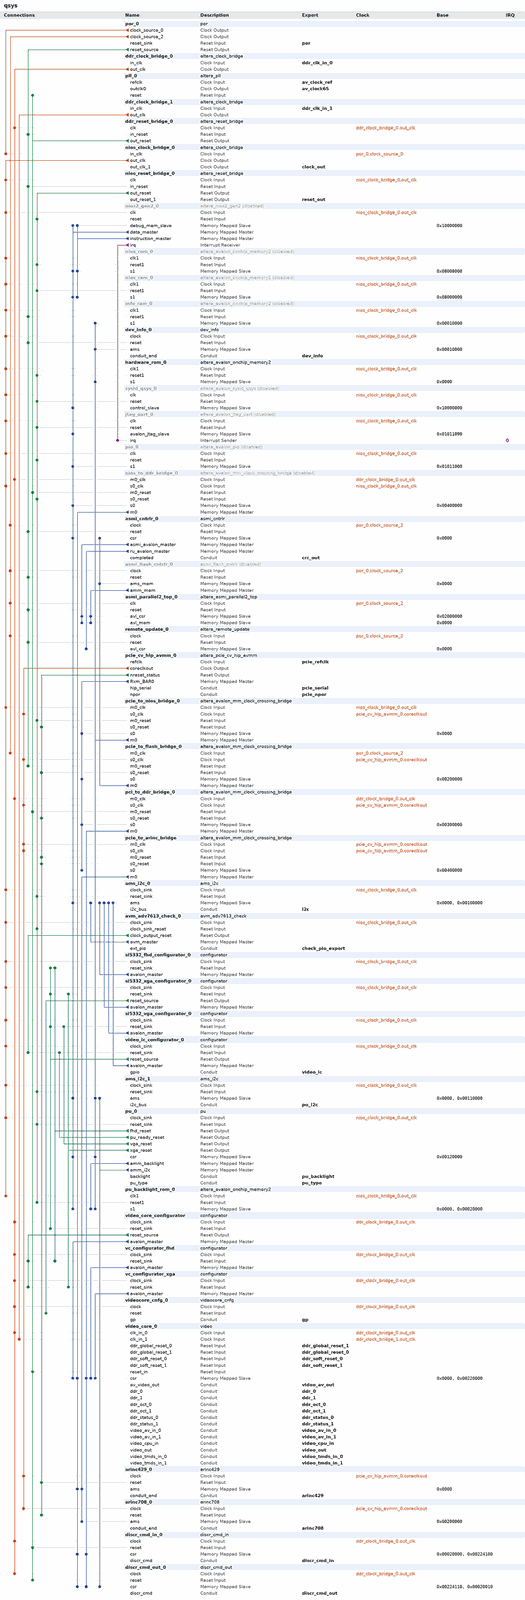
[diagram p0: system contents, whole]
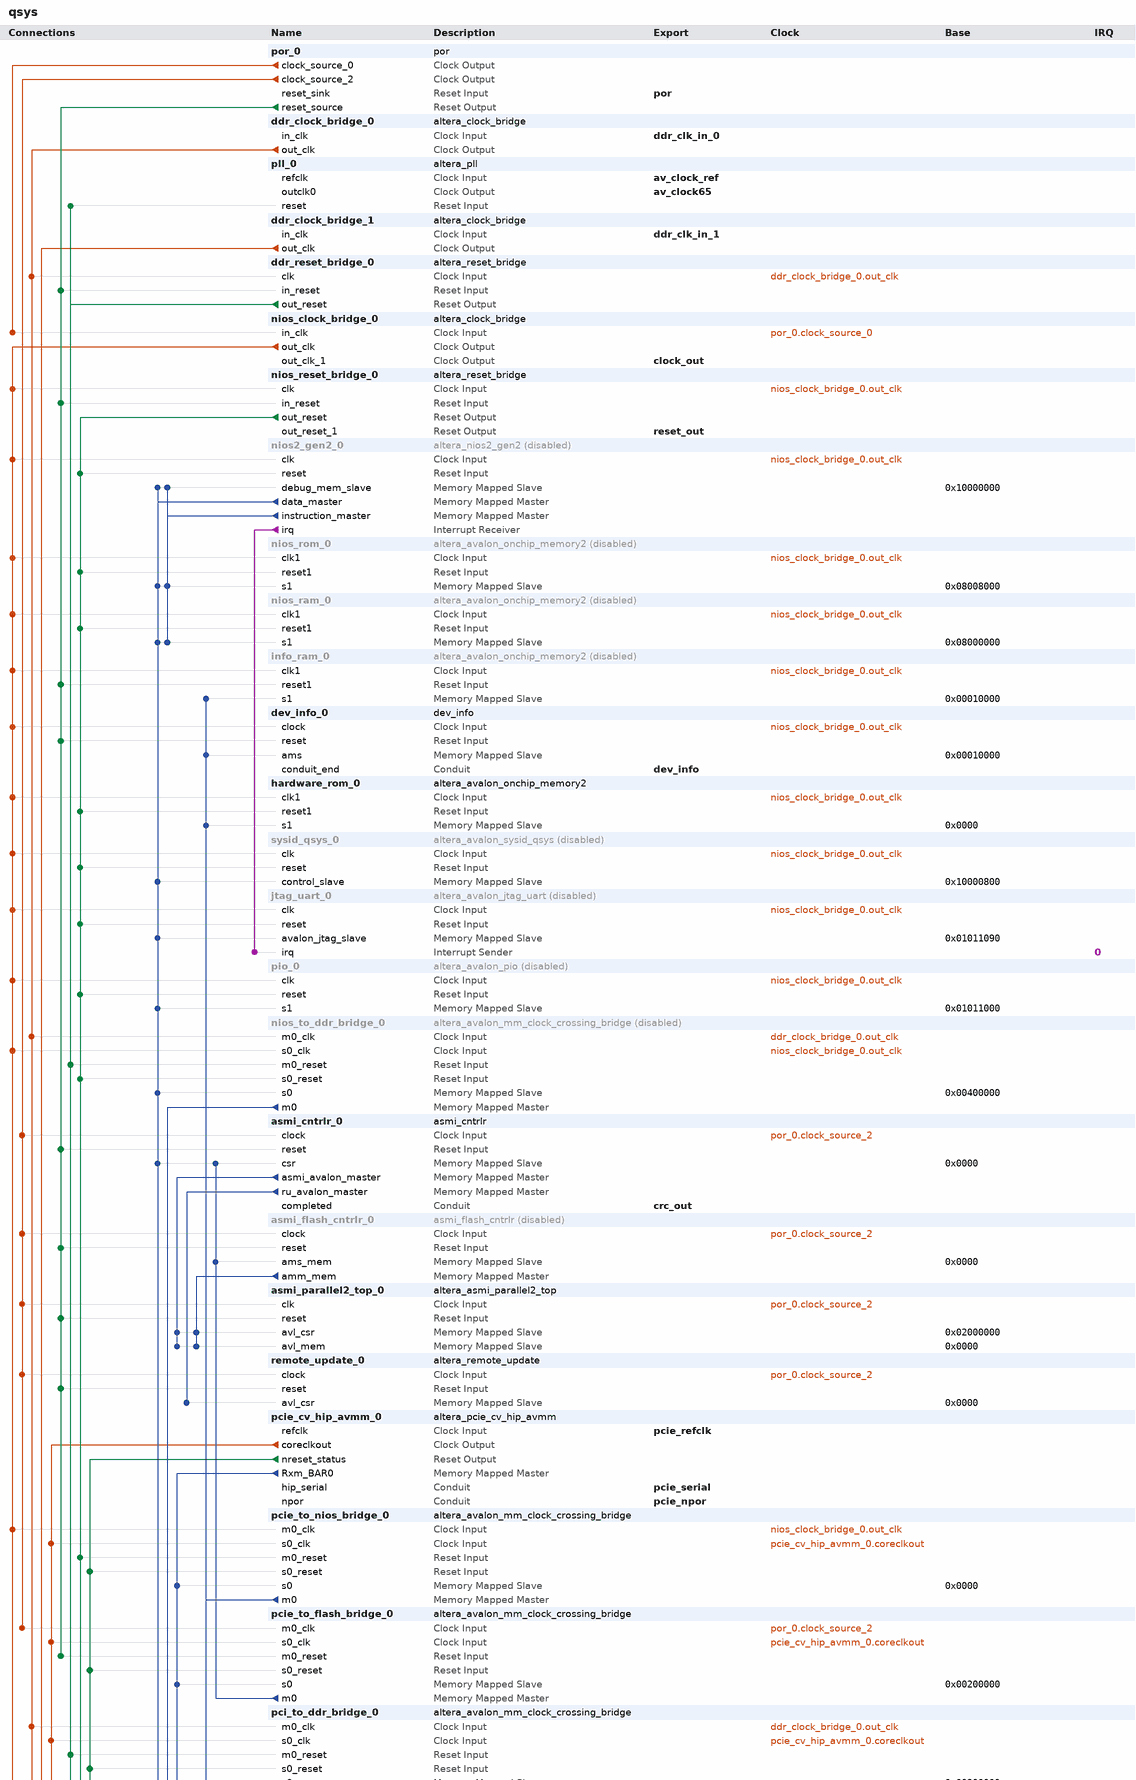
[diagram p1: system contents, upper part]
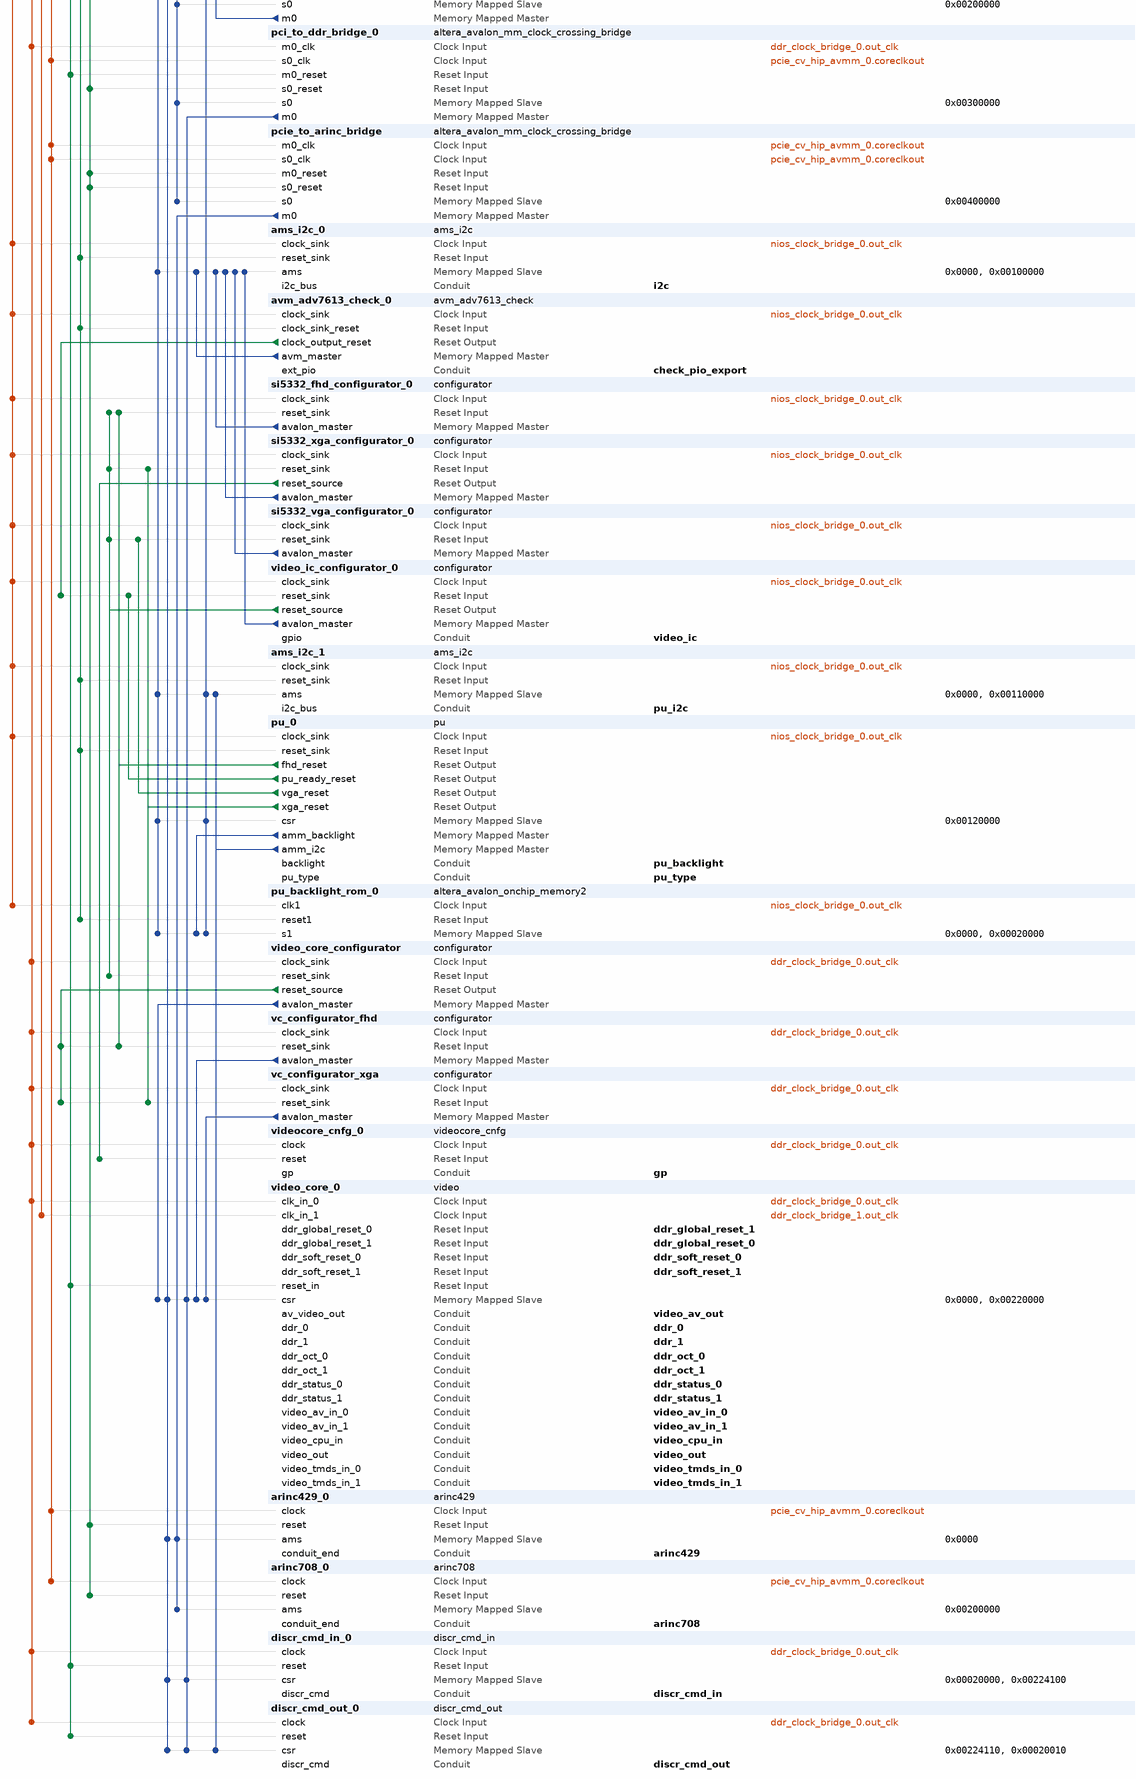
[diagram p2: system contents, lower part]
# Platform Designer (Qsys) system qsys, Cyclone V 5CGXFC7D6F31I7
# Parameters at their usual value, and those the tool derives, are not listed.
package require -exact qsys 18.1
create_system qsys
set_project_property DEVICE_FAMILY {Cyclone V}
set_project_property DEVICE 5CGXFC7D6F31I7

add_instance por_0 por 18.1
set_instance_parameter_value por_0 FAMILY {Cyclone V}

add_instance ddr_clock_bridge_0 altera_clock_bridge 18.1
set_instance_parameter_value ddr_clock_bridge_0 DERIVED_CLOCK_RATE 0
set_instance_parameter_value ddr_clock_bridge_0 EXPLICIT_CLOCK_RATE 100000000

add_instance pll_0 altera_pll 18.1
set_instance_parameter_value pll_0 gui_device_speed_grade 1
set_instance_parameter_value pll_0 gui_number_of_clocks 1
set_instance_parameter_value pll_0 gui_operation_mode normal
set_instance_parameter_value pll_0 gui_output_clock_frequency0 65.0
set_instance_parameter_value pll_0 gui_pll_mode {Integer-N PLL}
set_instance_parameter_value pll_0 gui_reference_clock_frequency 100.0
set_instance_parameter_value pll_0 gui_use_locked false

add_instance ddr_clock_bridge_1 altera_clock_bridge 18.1
set_instance_parameter_value ddr_clock_bridge_1 DERIVED_CLOCK_RATE 0
set_instance_parameter_value ddr_clock_bridge_1 EXPLICIT_CLOCK_RATE 100000000

add_instance ddr_reset_bridge_0 altera_reset_bridge 18.1
set_instance_parameter_value ddr_reset_bridge_0 ACTIVE_LOW_RESET 1
set_instance_parameter_value ddr_reset_bridge_0 SYNCHRONOUS_EDGES deassert
set_instance_parameter_value ddr_reset_bridge_0 USE_RESET_REQUEST 1

add_instance nios_clock_bridge_0 altera_clock_bridge 18.1
set_instance_parameter_value nios_clock_bridge_0 DERIVED_CLOCK_RATE 0
set_instance_parameter_value nios_clock_bridge_0 EXPLICIT_CLOCK_RATE 80000000
set_instance_parameter_value nios_clock_bridge_0 NUM_CLOCK_OUTPUTS 2

add_instance nios_reset_bridge_0 altera_reset_bridge 18.1
set_instance_parameter_value nios_reset_bridge_0 ACTIVE_LOW_RESET 1
set_instance_parameter_value nios_reset_bridge_0 NUM_RESET_OUTPUTS 2
set_instance_parameter_value nios_reset_bridge_0 SYNCHRONOUS_EDGES deassert
set_instance_parameter_value nios_reset_bridge_0 USE_RESET_REQUEST 1

add_instance nios2_gen2_0 altera_nios2_gen2 18.1
set_instance_property nios2_gen2_0 ENABLED false
set_instance_parameter_value nios2_gen2_0 dcache_size 0
set_instance_parameter_value nios2_gen2_0 debug_datatrigger 2
set_instance_parameter_value nios2_gen2_0 debug_hwbreakpoint 2
set_instance_parameter_value nios2_gen2_0 exceptionSlave nios_rom_0.s1
set_instance_parameter_value nios2_gen2_0 icache_size 0
set_instance_parameter_value nios2_gen2_0 impl Tiny
set_instance_parameter_value nios2_gen2_0 resetSlave nios_rom_0.s1
set_instance_parameter_value nios2_gen2_0 setting_branchpredictiontype Static

add_instance nios_rom_0 altera_avalon_onchip_memory2 18.1
set_instance_property nios_rom_0 ENABLED false
set_instance_parameter_value nios_rom_0 dataWidth 32
set_instance_parameter_value nios_rom_0 dualPort false
set_instance_parameter_value nios_rom_0 initMemContent true
set_instance_parameter_value nios_rom_0 initializationFileName nios_rom.hex
set_instance_parameter_value nios_rom_0 instanceID NIOS
set_instance_parameter_value nios_rom_0 memorySize 32768
set_instance_parameter_value nios_rom_0 useNonDefaultInitFile true
set_instance_parameter_value nios_rom_0 writable false

add_instance nios_ram_0 altera_avalon_onchip_memory2 18.1
set_instance_property nios_ram_0 ENABLED false
set_instance_parameter_value nios_ram_0 dataWidth 32
set_instance_parameter_value nios_ram_0 dualPort false
set_instance_parameter_value nios_ram_0 initMemContent true
set_instance_parameter_value nios_ram_0 initializationFileName nios_ram.hex
set_instance_parameter_value nios_ram_0 instanceID NIOS
set_instance_parameter_value nios_ram_0 memorySize 8192
set_instance_parameter_value nios_ram_0 useNonDefaultInitFile true

add_instance info_ram_0 altera_avalon_onchip_memory2 18.1
set_instance_property info_ram_0 ENABLED false
set_instance_parameter_value info_ram_0 dataWidth 32
set_instance_parameter_value info_ram_0 dualPort false
set_instance_parameter_value info_ram_0 initMemContent true
set_instance_parameter_value info_ram_0 initializationFileName info_ram.hex
set_instance_parameter_value info_ram_0 instanceID NIOS
set_instance_parameter_value info_ram_0 memorySize 1024
set_instance_parameter_value info_ram_0 useNonDefaultInitFile true

add_instance dev_info_0 dev_info 1.0
set_instance_parameter_value dev_info_0 INPUT_CLOCK 80000000

add_instance hardware_rom_0 altera_avalon_onchip_memory2 18.1
set_instance_parameter_value hardware_rom_0 dataWidth 32
set_instance_parameter_value hardware_rom_0 dualPort false
set_instance_parameter_value hardware_rom_0 initMemContent true
set_instance_parameter_value hardware_rom_0 initializationFileName hrom.hex
set_instance_parameter_value hardware_rom_0 instanceID HW
set_instance_parameter_value hardware_rom_0 memorySize 4096
set_instance_parameter_value hardware_rom_0 useNonDefaultInitFile true
set_instance_parameter_value hardware_rom_0 writable false

add_instance sysid_qsys_0 altera_avalon_sysid_qsys 18.1
set_instance_property sysid_qsys_0 ENABLED false
set_instance_parameter_value sysid_qsys_0 id 16777216

add_instance jtag_uart_0 altera_avalon_jtag_uart 18.1
set_instance_property jtag_uart_0 ENABLED false
set_instance_parameter_value jtag_uart_0 simInteractiveOptions NO_INTERACTIVE_WINDOWS

add_instance pio_0 altera_avalon_pio 18.1
set_instance_property pio_0 ENABLED false
set_instance_parameter_value pio_0 bitModifyingOutReg true
set_instance_parameter_value pio_0 direction InOut
set_instance_parameter_value pio_0 edgeType ANY
set_instance_parameter_value pio_0 width 32

add_instance nios_to_ddr_bridge_0 altera_avalon_mm_clock_crossing_bridge 18.1
set_instance_property nios_to_ddr_bridge_0 ENABLED false
set_instance_parameter_value nios_to_ddr_bridge_0 ADDRESS_UNITS WORDS
set_instance_parameter_value nios_to_ddr_bridge_0 ADDRESS_WIDTH 24
set_instance_parameter_value nios_to_ddr_bridge_0 COMMAND_FIFO_DEPTH 256
set_instance_parameter_value nios_to_ddr_bridge_0 DATA_WIDTH 32
set_instance_parameter_value nios_to_ddr_bridge_0 MASTER_SYNC_DEPTH 3
set_instance_parameter_value nios_to_ddr_bridge_0 MAX_BURST_SIZE 1
set_instance_parameter_value nios_to_ddr_bridge_0 RESPONSE_FIFO_DEPTH 256
set_instance_parameter_value nios_to_ddr_bridge_0 SLAVE_SYNC_DEPTH 3
set_instance_parameter_value nios_to_ddr_bridge_0 USE_AUTO_ADDRESS_WIDTH 1

add_instance asmi_cntrlr_0 asmi_cntrlr 1.0

add_instance asmi_flash_cntrlr_0 asmi_flash_cntrlr 1.0
set_instance_property asmi_flash_cntrlr_0 ENABLED false
set_instance_parameter_value asmi_flash_cntrlr_0 ASMI_CSR 33554432

add_instance asmi_parallel2_top_0 altera_asmi_parallel2_top 18.1
set_instance_parameter_value asmi_parallel2_top_0 CHIP_SELECT_EN true
set_instance_parameter_value asmi_parallel2_top_0 DATA_WIDTH QUAD
set_instance_parameter_value asmi_parallel2_top_0 ENABLE_SIM_MODEL false
set_instance_parameter_value asmi_parallel2_top_0 FLASH_TYPE EPCQL256
set_instance_parameter_value asmi_parallel2_top_0 NCS_NUM 1
set_instance_parameter_value asmi_parallel2_top_0 PIPE_CMD_GEN_CMD 0
set_instance_parameter_value asmi_parallel2_top_0 PIPE_CSR 0
set_instance_parameter_value asmi_parallel2_top_0 PIPE_MUX_CMD 0
set_instance_parameter_value asmi_parallel2_top_0 PIPE_XIP 0
set_instance_parameter_value asmi_parallel2_top_0 USE_ASMIBLOCK false
set_instance_parameter_value asmi_parallel2_top_0 USE_GPIO false

add_instance remote_update_0 altera_remote_update 18.1
set_instance_parameter_value remote_update_0 CBX_AUTO_BLACKBOX ALL
set_instance_parameter_value remote_update_0 DEVICE 5CGXFC7D6F31I7
set_instance_parameter_value remote_update_0 GUI_config_device MT25QL256
set_instance_parameter_value remote_update_0 check_app_pof false
set_instance_parameter_value remote_update_0 check_avalon_interface true
set_instance_parameter_value remote_update_0 m_support_write_config_check true
set_instance_parameter_value remote_update_0 operation_mode REMOTE

add_instance pcie_cv_hip_avmm_0 altera_pcie_cv_hip_avmm 18.1
set_instance_parameter_value pcie_cv_hip_avmm_0 AST_LITE 0
set_instance_parameter_value pcie_cv_hip_avmm_0 AVALON_ADDR_WIDTH 32
set_instance_parameter_value pcie_cv_hip_avmm_0 AddressPage "0\\,1\\,2\\,3\\,4\\,5\\,6\\,7\\,8\\,9\\,10\\,11\\,12\\,13\\,14\\,15"
set_instance_parameter_value pcie_cv_hip_avmm_0 BYPASSS_A2P_TRANSLATION 0
set_instance_parameter_value pcie_cv_hip_avmm_0 CB_A2P_ADDR_MAP_FIXED_TABLE_0_HIGH 0
set_instance_parameter_value pcie_cv_hip_avmm_0 CB_A2P_ADDR_MAP_FIXED_TABLE_0_LOW 0
set_instance_parameter_value pcie_cv_hip_avmm_0 CB_A2P_ADDR_MAP_FIXED_TABLE_10_HIGH 0
set_instance_parameter_value pcie_cv_hip_avmm_0 CB_A2P_ADDR_MAP_FIXED_TABLE_10_LOW 0
set_instance_parameter_value pcie_cv_hip_avmm_0 CB_A2P_ADDR_MAP_FIXED_TABLE_11_HIGH 0
set_instance_parameter_value pcie_cv_hip_avmm_0 CB_A2P_ADDR_MAP_FIXED_TABLE_11_LOW 0
set_instance_parameter_value pcie_cv_hip_avmm_0 CB_A2P_ADDR_MAP_FIXED_TABLE_12_HIGH 0
set_instance_parameter_value pcie_cv_hip_avmm_0 CB_A2P_ADDR_MAP_FIXED_TABLE_12_LOW 0
set_instance_parameter_value pcie_cv_hip_avmm_0 CB_A2P_ADDR_MAP_FIXED_TABLE_13_HIGH 0
set_instance_parameter_value pcie_cv_hip_avmm_0 CB_A2P_ADDR_MAP_FIXED_TABLE_13_LOW 0
set_instance_parameter_value pcie_cv_hip_avmm_0 CB_A2P_ADDR_MAP_FIXED_TABLE_14_HIGH 0
set_instance_parameter_value pcie_cv_hip_avmm_0 CB_A2P_ADDR_MAP_FIXED_TABLE_14_LOW 0
set_instance_parameter_value pcie_cv_hip_avmm_0 CB_A2P_ADDR_MAP_FIXED_TABLE_15_HIGH 0
set_instance_parameter_value pcie_cv_hip_avmm_0 CB_A2P_ADDR_MAP_FIXED_TABLE_15_LOW 0
set_instance_parameter_value pcie_cv_hip_avmm_0 CB_A2P_ADDR_MAP_FIXED_TABLE_1_HIGH 0
set_instance_parameter_value pcie_cv_hip_avmm_0 CB_A2P_ADDR_MAP_FIXED_TABLE_1_LOW 0
set_instance_parameter_value pcie_cv_hip_avmm_0 CB_A2P_ADDR_MAP_FIXED_TABLE_2_HIGH 0
set_instance_parameter_value pcie_cv_hip_avmm_0 CB_A2P_ADDR_MAP_FIXED_TABLE_2_LOW 0
set_instance_parameter_value pcie_cv_hip_avmm_0 CB_A2P_ADDR_MAP_FIXED_TABLE_3_HIGH 0
set_instance_parameter_value pcie_cv_hip_avmm_0 CB_A2P_ADDR_MAP_FIXED_TABLE_3_LOW 0
set_instance_parameter_value pcie_cv_hip_avmm_0 CB_A2P_ADDR_MAP_FIXED_TABLE_4_HIGH 0
set_instance_parameter_value pcie_cv_hip_avmm_0 CB_A2P_ADDR_MAP_FIXED_TABLE_4_LOW 0
set_instance_parameter_value pcie_cv_hip_avmm_0 CB_A2P_ADDR_MAP_FIXED_TABLE_5_HIGH 0
set_instance_parameter_value pcie_cv_hip_avmm_0 CB_A2P_ADDR_MAP_FIXED_TABLE_5_LOW 0
set_instance_parameter_value pcie_cv_hip_avmm_0 CB_A2P_ADDR_MAP_FIXED_TABLE_6_HIGH 0
set_instance_parameter_value pcie_cv_hip_avmm_0 CB_A2P_ADDR_MAP_FIXED_TABLE_6_LOW 0
set_instance_parameter_value pcie_cv_hip_avmm_0 CB_A2P_ADDR_MAP_FIXED_TABLE_7_HIGH 0
set_instance_parameter_value pcie_cv_hip_avmm_0 CB_A2P_ADDR_MAP_FIXED_TABLE_7_LOW 0
set_instance_parameter_value pcie_cv_hip_avmm_0 CB_A2P_ADDR_MAP_FIXED_TABLE_8_HIGH 0
set_instance_parameter_value pcie_cv_hip_avmm_0 CB_A2P_ADDR_MAP_FIXED_TABLE_8_LOW 0
set_instance_parameter_value pcie_cv_hip_avmm_0 CB_A2P_ADDR_MAP_FIXED_TABLE_9_HIGH 0
set_instance_parameter_value pcie_cv_hip_avmm_0 CB_A2P_ADDR_MAP_FIXED_TABLE_9_LOW 0
set_instance_parameter_value pcie_cv_hip_avmm_0 CB_A2P_ADDR_MAP_IS_FIXED 0
set_instance_parameter_value pcie_cv_hip_avmm_0 CB_A2P_ADDR_MAP_NUM_ENTRIES 2
set_instance_parameter_value pcie_cv_hip_avmm_0 CB_A2P_ADDR_MAP_PASS_THRU_BITS 20
set_instance_parameter_value pcie_cv_hip_avmm_0 CB_P2A_AVALON_ADDR_B0 0x00000000
set_instance_parameter_value pcie_cv_hip_avmm_0 CB_P2A_AVALON_ADDR_B1 0x00000000
set_instance_parameter_value pcie_cv_hip_avmm_0 CB_P2A_AVALON_ADDR_B2 0x00000000
set_instance_parameter_value pcie_cv_hip_avmm_0 CB_P2A_AVALON_ADDR_B3 0x00000000
set_instance_parameter_value pcie_cv_hip_avmm_0 CB_P2A_AVALON_ADDR_B4 0x00000000
set_instance_parameter_value pcie_cv_hip_avmm_0 CB_P2A_AVALON_ADDR_B5 0x00000000
set_instance_parameter_value pcie_cv_hip_avmm_0 CB_P2A_FIXED_AVALON_ADDR_B0 0
set_instance_parameter_value pcie_cv_hip_avmm_0 CB_P2A_FIXED_AVALON_ADDR_B1 0
set_instance_parameter_value pcie_cv_hip_avmm_0 CB_P2A_FIXED_AVALON_ADDR_B2 0
set_instance_parameter_value pcie_cv_hip_avmm_0 CB_P2A_FIXED_AVALON_ADDR_B3 0
set_instance_parameter_value pcie_cv_hip_avmm_0 CB_P2A_FIXED_AVALON_ADDR_B4 0
set_instance_parameter_value pcie_cv_hip_avmm_0 CB_P2A_FIXED_AVALON_ADDR_B5 0
set_instance_parameter_value pcie_cv_hip_avmm_0 CB_PCIE_MODE 1
set_instance_parameter_value pcie_cv_hip_avmm_0 CB_PCIE_RX_LITE 1
set_instance_parameter_value pcie_cv_hip_avmm_0 CB_RP_S_ADDR_WIDTH 32
set_instance_parameter_value pcie_cv_hip_avmm_0 CG_COMMON_CLOCK_MODE 1
set_instance_parameter_value pcie_cv_hip_avmm_0 CG_ENABLE_A2P_INTERRUPT 1
set_instance_parameter_value pcie_cv_hip_avmm_0 CG_ENABLE_ADVANCED_INTERRUPT 0
set_instance_parameter_value pcie_cv_hip_avmm_0 CG_ENABLE_HIP_STATUS 0
set_instance_parameter_value pcie_cv_hip_avmm_0 CG_ENABLE_HIP_STATUS_EXTENSION 0
set_instance_parameter_value pcie_cv_hip_avmm_0 CG_IMPL_CRA_AV_SLAVE_PORT 0
set_instance_parameter_value pcie_cv_hip_avmm_0 CG_RXM_IRQ_NUM 16
set_instance_parameter_value pcie_cv_hip_avmm_0 NUM_PREFETCH_MASTERS 1
set_instance_parameter_value pcie_cv_hip_avmm_0 PCIeAddress31_0 "0x00000000\\,0x00000000\\,0x00000000\\,0x00000000\\,0x00000000\\,0x00000000\\,0x00000000\\,0x00000000\\,0x00000000\\,0x00000000\\,0x00000000\\,0x00000000\\,0x00000000\\,0x00000000\\,0x00000000\\,0x00000000"
set_instance_parameter_value pcie_cv_hip_avmm_0 PCIeAddress63_32 "0x00000000\\,0x00000000\\,0x00000000\\,0x00000000\\,0x00000000\\,0x00000000\\,0x00000000\\,0x00000000\\,0x00000000\\,0x00000000\\,0x00000000\\,0x00000000\\,0x00000000\\,0x00000000\\,0x00000000\\,0x00000000"
set_instance_parameter_value pcie_cv_hip_avmm_0 RXM_BEN_WIDTH 8
set_instance_parameter_value pcie_cv_hip_avmm_0 RXM_DATA_WIDTH 64
set_instance_parameter_value pcie_cv_hip_avmm_0 SLAVE_ADDRESS_MAP_0 23
set_instance_parameter_value pcie_cv_hip_avmm_0 SLAVE_ADDRESS_MAP_1 0
set_instance_parameter_value pcie_cv_hip_avmm_0 SLAVE_ADDRESS_MAP_2 0
set_instance_parameter_value pcie_cv_hip_avmm_0 SLAVE_ADDRESS_MAP_3 0
set_instance_parameter_value pcie_cv_hip_avmm_0 SLAVE_ADDRESS_MAP_4 0
set_instance_parameter_value pcie_cv_hip_avmm_0 SLAVE_ADDRESS_MAP_5 0
set_instance_parameter_value pcie_cv_hip_avmm_0 TX_S_ADDR_WIDTH 32
set_instance_parameter_value pcie_cv_hip_avmm_0 advanced_default_parameter_override 0
set_instance_parameter_value pcie_cv_hip_avmm_0 altpcie_avmm_hwtcl 1
set_instance_parameter_value pcie_cv_hip_avmm_0 atomic_malformed_hwtcl true
set_instance_parameter_value pcie_cv_hip_avmm_0 atomic_op_completer_32bit_hwtcl false
set_instance_parameter_value pcie_cv_hip_avmm_0 atomic_op_completer_64bit_hwtcl false
set_instance_parameter_value pcie_cv_hip_avmm_0 atomic_op_routing_hwtcl false
set_instance_parameter_value pcie_cv_hip_avmm_0 avmm_width_hwtcl 64
set_instance_parameter_value pcie_cv_hip_avmm_0 bar0_type_hwtcl 2
set_instance_parameter_value pcie_cv_hip_avmm_0 bar1_type_hwtcl 0
set_instance_parameter_value pcie_cv_hip_avmm_0 bar2_type_hwtcl 0
set_instance_parameter_value pcie_cv_hip_avmm_0 bar3_type_hwtcl 0
set_instance_parameter_value pcie_cv_hip_avmm_0 bar4_type_hwtcl 0
set_instance_parameter_value pcie_cv_hip_avmm_0 bar5_type_hwtcl 0
set_instance_parameter_value pcie_cv_hip_avmm_0 bridge_port_ssid_support_hwtcl false
set_instance_parameter_value pcie_cv_hip_avmm_0 bridge_port_vga_enable_hwtcl false
set_instance_parameter_value pcie_cv_hip_avmm_0 bypass_cdc_hwtcl false
set_instance_parameter_value pcie_cv_hip_avmm_0 bypass_tl false
set_instance_parameter_value pcie_cv_hip_avmm_0 cas_completer_128bit_hwtcl false
set_instance_parameter_value pcie_cv_hip_avmm_0 cdc_dummy_insert_limit_advanced_default_hwtcl 11
set_instance_parameter_value pcie_cv_hip_avmm_0 class_code_hwtcl 16711680
set_instance_parameter_value pcie_cv_hip_avmm_0 completion_timeout_hwtcl A
set_instance_parameter_value pcie_cv_hip_avmm_0 coreclkout_hip_phaseshift_hwtcl {0 ps}
set_instance_parameter_value pcie_cv_hip_avmm_0 d0_pme_advanced_default_hwtcl false
set_instance_parameter_value pcie_cv_hip_avmm_0 d1_pme_advanced_default_hwtcl false
set_instance_parameter_value pcie_cv_hip_avmm_0 d1_support_advanced_default_hwtcl false
set_instance_parameter_value pcie_cv_hip_avmm_0 d2_pme_advanced_default_hwtcl false
set_instance_parameter_value pcie_cv_hip_avmm_0 d2_support_advanced_default_hwtcl false
set_instance_parameter_value pcie_cv_hip_avmm_0 d3_cold_pme_advanced_default_hwtcl false
set_instance_parameter_value pcie_cv_hip_avmm_0 d3_hot_pme_advanced_default_hwtcl false
set_instance_parameter_value pcie_cv_hip_avmm_0 data_pack_rx_hwtcl disable
set_instance_parameter_value pcie_cv_hip_avmm_0 deemphasis_enable_advanced_default_hwtcl false
set_instance_parameter_value pcie_cv_hip_avmm_0 deskew_comma_hwtcl skp_eieos_deskw
set_instance_parameter_value pcie_cv_hip_avmm_0 device_id_hwtcl 2
set_instance_parameter_value pcie_cv_hip_avmm_0 device_number_advanced_default_hwtcl 0
set_instance_parameter_value pcie_cv_hip_avmm_0 diffclock_nfts_count_advanced_default_hwtcl 255
set_instance_parameter_value pcie_cv_hip_avmm_0 disable_link_x2_support_advanced_default_hwtcl false
set_instance_parameter_value pcie_cv_hip_avmm_0 disable_snoop_packet_hwtcl false
set_instance_parameter_value pcie_cv_hip_avmm_0 dll_active_report_support_hwtcl 0
set_instance_parameter_value pcie_cv_hip_avmm_0 ecrc_check_capable_hwtcl 0
set_instance_parameter_value pcie_cv_hip_avmm_0 ecrc_gen_capable_hwtcl 0
set_instance_parameter_value pcie_cv_hip_avmm_0 ei_delay_powerdown_count_advanced_default_hwtcl 10
set_instance_parameter_value pcie_cv_hip_avmm_0 eie_before_nfts_count_advanced_default_hwtcl 4
set_instance_parameter_value pcie_cv_hip_avmm_0 enable_completion_timeout_disable_hwtcl 0
set_instance_parameter_value pcie_cv_hip_avmm_0 enable_function_msix_support_hwtcl 0
set_instance_parameter_value pcie_cv_hip_avmm_0 enable_l0s_aspm_hwtcl true
set_instance_parameter_value pcie_cv_hip_avmm_0 enable_l1_aspm_advanced_default_hwtcl false
set_instance_parameter_value pcie_cv_hip_avmm_0 enable_rx_buffer_checking_advanced_default_hwtcl false
set_instance_parameter_value pcie_cv_hip_avmm_0 enable_slot_register_hwtcl 0
set_instance_parameter_value pcie_cv_hip_avmm_0 endpoint_l0_latency_hwtcl 0
set_instance_parameter_value pcie_cv_hip_avmm_0 endpoint_l1_latency_hwtcl 0
set_instance_parameter_value pcie_cv_hip_avmm_0 expansion_base_address_register_hwtcl 0
set_instance_parameter_value pcie_cv_hip_avmm_0 extend_tag_field_hwtcl 32
set_instance_parameter_value pcie_cv_hip_avmm_0 extended_format_field_hwtcl true
set_instance_parameter_value pcie_cv_hip_avmm_0 extended_tag_reset_hwtcl false
set_instance_parameter_value pcie_cv_hip_avmm_0 fc_init_timer_advanced_default_hwtcl 1024
set_instance_parameter_value pcie_cv_hip_avmm_0 fixed_address_mode 0
set_instance_parameter_value pcie_cv_hip_avmm_0 flow_control_timeout_count_advanced_default_hwtcl 200
set_instance_parameter_value pcie_cv_hip_avmm_0 flow_control_update_count_advanced_default_hwtcl 30
set_instance_parameter_value pcie_cv_hip_avmm_0 flr_capability_hwtcl 0
set_instance_parameter_value pcie_cv_hip_avmm_0 force_hrc 0
set_instance_parameter_value pcie_cv_hip_avmm_0 force_src 0
set_instance_parameter_value pcie_cv_hip_avmm_0 gen123_lane_rate_mode_hwtcl {Gen1 (2.5 Gbps)}
set_instance_parameter_value pcie_cv_hip_avmm_0 gen2_diffclock_nfts_count_advanced_default_hwtcl 255
set_instance_parameter_value pcie_cv_hip_avmm_0 gen2_sameclock_nfts_count_advanced_default_hwtcl 255
set_instance_parameter_value pcie_cv_hip_avmm_0 gen3_rxfreqlock_counter_hwtcl 0
set_instance_parameter_value pcie_cv_hip_avmm_0 hip_reconfig_hwtcl 0
set_instance_parameter_value pcie_cv_hip_avmm_0 hot_plug_support_advanced_default_hwtcl 0
set_instance_parameter_value pcie_cv_hip_avmm_0 in_cvp_mode_hwtcl 0
set_instance_parameter_value pcie_cv_hip_avmm_0 indicator_advanced_default_hwtcl 0
set_instance_parameter_value pcie_cv_hip_avmm_0 interrupt_pin_hwtcl inta
set_instance_parameter_value pcie_cv_hip_avmm_0 io_window_addr_width_hwtcl 0
set_instance_parameter_value pcie_cv_hip_avmm_0 l01_entry_latency_advanced_default_hwtcl 31
set_instance_parameter_value pcie_cv_hip_avmm_0 l0_exit_latency_diffclock_advanced_default_hwtcl 6
set_instance_parameter_value pcie_cv_hip_avmm_0 l0_exit_latency_sameclock_advanced_default_hwtcl 6
set_instance_parameter_value pcie_cv_hip_avmm_0 l1_exit_latency_diffclock_advanced_default_hwtcl 0
set_instance_parameter_value pcie_cv_hip_avmm_0 l1_exit_latency_sameclock_advanced_default_hwtcl 0
set_instance_parameter_value pcie_cv_hip_avmm_0 l2_async_logic_advanced_default_hwtcl disable
set_instance_parameter_value pcie_cv_hip_avmm_0 lane_mask_hwtcl x1
set_instance_parameter_value pcie_cv_hip_avmm_0 low_priority_vc_advanced_default_hwtcl single_vc
set_instance_parameter_value pcie_cv_hip_avmm_0 ltr_mechanism_hwtcl false
set_instance_parameter_value pcie_cv_hip_avmm_0 ltssm_1ms_timeout_hwtcl disable
set_instance_parameter_value pcie_cv_hip_avmm_0 ltssm_freqlocked_check_hwtcl disable
set_instance_parameter_value pcie_cv_hip_avmm_0 max_payload_size_hwtcl 128
set_instance_parameter_value pcie_cv_hip_avmm_0 maximum_current_hwtcl 0
set_instance_parameter_value pcie_cv_hip_avmm_0 msi_64bit_addressing_capable_hwtcl true
set_instance_parameter_value pcie_cv_hip_avmm_0 msi_masking_capable_hwtcl false
set_instance_parameter_value pcie_cv_hip_avmm_0 msi_multi_message_capable_hwtcl 1
set_instance_parameter_value pcie_cv_hip_avmm_0 msi_support_hwtcl true
set_instance_parameter_value pcie_cv_hip_avmm_0 msix_pba_bir_hwtcl 0
set_instance_parameter_value pcie_cv_hip_avmm_0 msix_pba_offset_hwtcl 0
set_instance_parameter_value pcie_cv_hip_avmm_0 msix_table_bir_hwtcl 0
set_instance_parameter_value pcie_cv_hip_avmm_0 msix_table_offset_hwtcl 0
set_instance_parameter_value pcie_cv_hip_avmm_0 msix_table_size_hwtcl 0
set_instance_parameter_value pcie_cv_hip_avmm_0 no_command_completed_advanced_default_hwtcl false
set_instance_parameter_value pcie_cv_hip_avmm_0 no_soft_reset_advanced_default_hwtcl false
set_instance_parameter_value pcie_cv_hip_avmm_0 override_rxbuffer_cred_preset 0
set_instance_parameter_value pcie_cv_hip_avmm_0 override_tbpartner_driver_setting_hwtcl 0
set_instance_parameter_value pcie_cv_hip_avmm_0 pcie_qsys 1
set_instance_parameter_value pcie_cv_hip_avmm_0 pclk_out_sel_advanced_default_hwtcl pclk
set_instance_parameter_value pcie_cv_hip_avmm_0 pipex1_debug_sel_advanced_default_hwtcl disable
set_instance_parameter_value pcie_cv_hip_avmm_0 pldclk_hip_phase_shift_hwtcl {0 ps}
set_instance_parameter_value pcie_cv_hip_avmm_0 pll_refclk_freq_hwtcl {100 MHz}
set_instance_parameter_value pcie_cv_hip_avmm_0 port_link_number_hwtcl 1
set_instance_parameter_value pcie_cv_hip_avmm_0 port_type_hwtcl {Native endpoint}
set_instance_parameter_value pcie_cv_hip_avmm_0 prefetchable_mem_window_addr_width_hwtcl 0
set_instance_parameter_value pcie_cv_hip_avmm_0 register_pipe_signals_advanced_default_hwtcl true
set_instance_parameter_value pcie_cv_hip_avmm_0 reserved_debug_advanced_default_hwtcl 0
set_instance_parameter_value pcie_cv_hip_avmm_0 retry_buffer_last_active_address_advanced_default_hwtcl 255
set_instance_parameter_value pcie_cv_hip_avmm_0 revision_id_hwtcl 1
set_instance_parameter_value pcie_cv_hip_avmm_0 rpre_emph_a_val_hwtcl 11
set_instance_parameter_value pcie_cv_hip_avmm_0 rpre_emph_b_val_hwtcl 0
set_instance_parameter_value pcie_cv_hip_avmm_0 rpre_emph_c_val_hwtcl 22
set_instance_parameter_value pcie_cv_hip_avmm_0 rpre_emph_d_val_hwtcl 12
set_instance_parameter_value pcie_cv_hip_avmm_0 rpre_emph_e_val_hwtcl 21
set_instance_parameter_value pcie_cv_hip_avmm_0 rvod_sel_a_val_hwtcl 50
set_instance_parameter_value pcie_cv_hip_avmm_0 rvod_sel_b_val_hwtcl 34
set_instance_parameter_value pcie_cv_hip_avmm_0 rvod_sel_c_val_hwtcl 50
set_instance_parameter_value pcie_cv_hip_avmm_0 rvod_sel_d_val_hwtcl 50
set_instance_parameter_value pcie_cv_hip_avmm_0 rvod_sel_e_val_hwtcl 9
set_instance_parameter_value pcie_cv_hip_avmm_0 rx_cdc_almost_full_advanced_default_hwtcl 12
set_instance_parameter_value pcie_cv_hip_avmm_0 rx_l0s_count_idl_advanced_default_hwtcl 0
set_instance_parameter_value pcie_cv_hip_avmm_0 rxbuffer_rxreq_hwtcl Minimum
set_instance_parameter_value pcie_cv_hip_avmm_0 sameclock_nfts_count_advanced_default_hwtcl 255
set_instance_parameter_value pcie_cv_hip_avmm_0 serial_sim_hwtcl 0
set_instance_parameter_value pcie_cv_hip_avmm_0 set_pld_clk_x1_625MHz_hwtcl 1
set_instance_parameter_value pcie_cv_hip_avmm_0 skp_os_gen3_count_hwtcl 0
set_instance_parameter_value pcie_cv_hip_avmm_0 skp_os_schedule_count_advanced_default_hwtcl 0
set_instance_parameter_value pcie_cv_hip_avmm_0 slot_number_hwtcl 0
set_instance_parameter_value pcie_cv_hip_avmm_0 slot_power_limit_hwtcl 0
set_instance_parameter_value pcie_cv_hip_avmm_0 slot_power_scale_hwtcl 0
set_instance_parameter_value pcie_cv_hip_avmm_0 slotclkcfg_hwtcl 1
set_instance_parameter_value pcie_cv_hip_avmm_0 ssid_hwtcl 0
set_instance_parameter_value pcie_cv_hip_avmm_0 ssvid_hwtcl 0
set_instance_parameter_value pcie_cv_hip_avmm_0 subsystem_device_id_hwtcl 2
set_instance_parameter_value pcie_cv_hip_avmm_0 subsystem_vendor_id_hwtcl 16723
set_instance_parameter_value pcie_cv_hip_avmm_0 surprise_down_error_support_hwtcl 0
set_instance_parameter_value pcie_cv_hip_avmm_0 tph_completer_hwtcl false
set_instance_parameter_value pcie_cv_hip_avmm_0 tx_cdc_almost_empty_advanced_default_hwtcl 5
set_instance_parameter_value pcie_cv_hip_avmm_0 tx_cdc_almost_full_advanced_default_hwtcl 11
set_instance_parameter_value pcie_cv_hip_avmm_0 use_aer_hwtcl 0
set_instance_parameter_value pcie_cv_hip_avmm_0 use_ast_parity 0
set_instance_parameter_value pcie_cv_hip_avmm_0 use_crc_forwarding_hwtcl 0
set_instance_parameter_value pcie_cv_hip_avmm_0 use_rx_st_be_hwtcl 0
set_instance_parameter_value pcie_cv_hip_avmm_0 use_tl_cfg_sync_advanced_default_hwtcl 1
set_instance_parameter_value pcie_cv_hip_avmm_0 user_id_hwtcl 0
set_instance_parameter_value pcie_cv_hip_avmm_0 vc0_clk_enable_advanced_default_hwtcl true
set_instance_parameter_value pcie_cv_hip_avmm_0 vendor_id_hwtcl 16723
set_instance_parameter_value pcie_cv_hip_avmm_0 vsec_id_hwtcl 4466
set_instance_parameter_value pcie_cv_hip_avmm_0 vsec_rev_hwtcl 0
set_instance_parameter_value pcie_cv_hip_avmm_0 wrong_device_id_hwtcl disable

add_instance pcie_to_nios_bridge_0 altera_avalon_mm_clock_crossing_bridge 18.1
set_instance_parameter_value pcie_to_nios_bridge_0 ADDRESS_UNITS WORDS
set_instance_parameter_value pcie_to_nios_bridge_0 ADDRESS_WIDTH 19
set_instance_parameter_value pcie_to_nios_bridge_0 COMMAND_FIFO_DEPTH 256
set_instance_parameter_value pcie_to_nios_bridge_0 DATA_WIDTH 32
set_instance_parameter_value pcie_to_nios_bridge_0 MASTER_SYNC_DEPTH 3
set_instance_parameter_value pcie_to_nios_bridge_0 MAX_BURST_SIZE 1
set_instance_parameter_value pcie_to_nios_bridge_0 RESPONSE_FIFO_DEPTH 256
set_instance_parameter_value pcie_to_nios_bridge_0 SLAVE_SYNC_DEPTH 3
set_instance_parameter_value pcie_to_nios_bridge_0 USE_AUTO_ADDRESS_WIDTH 1

add_instance pcie_to_flash_bridge_0 altera_avalon_mm_clock_crossing_bridge 18.1
set_instance_parameter_value pcie_to_flash_bridge_0 ADDRESS_UNITS WORDS
set_instance_parameter_value pcie_to_flash_bridge_0 ADDRESS_WIDTH 21
set_instance_parameter_value pcie_to_flash_bridge_0 COMMAND_FIFO_DEPTH 256
set_instance_parameter_value pcie_to_flash_bridge_0 DATA_WIDTH 32
set_instance_parameter_value pcie_to_flash_bridge_0 MASTER_SYNC_DEPTH 3
set_instance_parameter_value pcie_to_flash_bridge_0 MAX_BURST_SIZE 1
set_instance_parameter_value pcie_to_flash_bridge_0 RESPONSE_FIFO_DEPTH 256
set_instance_parameter_value pcie_to_flash_bridge_0 SLAVE_SYNC_DEPTH 3
set_instance_parameter_value pcie_to_flash_bridge_0 USE_AUTO_ADDRESS_WIDTH 1

add_instance pci_to_ddr_bridge_0 altera_avalon_mm_clock_crossing_bridge 18.1
set_instance_parameter_value pci_to_ddr_bridge_0 ADDRESS_UNITS WORDS
set_instance_parameter_value pci_to_ddr_bridge_0 ADDRESS_WIDTH 19
set_instance_parameter_value pci_to_ddr_bridge_0 COMMAND_FIFO_DEPTH 256
set_instance_parameter_value pci_to_ddr_bridge_0 DATA_WIDTH 32
set_instance_parameter_value pci_to_ddr_bridge_0 MASTER_SYNC_DEPTH 3
set_instance_parameter_value pci_to_ddr_bridge_0 MAX_BURST_SIZE 1
set_instance_parameter_value pci_to_ddr_bridge_0 RESPONSE_FIFO_DEPTH 256
set_instance_parameter_value pci_to_ddr_bridge_0 SLAVE_SYNC_DEPTH 3
set_instance_parameter_value pci_to_ddr_bridge_0 USE_AUTO_ADDRESS_WIDTH 1

add_instance pcie_to_arinc_bridge altera_avalon_mm_clock_crossing_bridge 18.1
set_instance_parameter_value pcie_to_arinc_bridge ADDRESS_UNITS WORDS
set_instance_parameter_value pcie_to_arinc_bridge ADDRESS_WIDTH 19
set_instance_parameter_value pcie_to_arinc_bridge COMMAND_FIFO_DEPTH 256
set_instance_parameter_value pcie_to_arinc_bridge DATA_WIDTH 32
set_instance_parameter_value pcie_to_arinc_bridge MASTER_SYNC_DEPTH 3
set_instance_parameter_value pcie_to_arinc_bridge MAX_BURST_SIZE 1
set_instance_parameter_value pcie_to_arinc_bridge RESPONSE_FIFO_DEPTH 256
set_instance_parameter_value pcie_to_arinc_bridge SLAVE_SYNC_DEPTH 3
set_instance_parameter_value pcie_to_arinc_bridge USE_AUTO_ADDRESS_WIDTH 1

add_instance ams_i2c_0 ams_i2c 18.0
set_instance_parameter_value ams_i2c_0 baudrate 100000
set_instance_parameter_value ams_i2c_0 clock_freq 80000000

add_instance avm_adv7613_check_0 avm_adv7613_check 1.0
set_instance_parameter_value avm_adv7613_check_0 ADV7613_I2C_ADDRESS 0
set_instance_parameter_value avm_adv7613_check_0 ADV7613_TIMER_RESET_MKS 10000
set_instance_parameter_value avm_adv7613_check_0 AMS_I2C_AMM_ADDRESS 0
set_instance_parameter_value avm_adv7613_check_0 TIMER_DELAY_MKS 500000

add_instance si5332_fhd_configurator_0 configurator 18.1
set_instance_parameter_value si5332_fhd_configurator_0 ADDR_OUT_WIDTH 16
set_instance_parameter_value si5332_fhd_configurator_0 DATA_OUT_WIDTH 8
set_instance_parameter_value si5332_fhd_configurator_0 DELAY_MS 0
set_instance_parameter_value si5332_fhd_configurator_0 FAMILY {Cyclone V}
set_instance_parameter_value si5332_fhd_configurator_0 INPUT_FREQ 100000000
set_instance_parameter_value si5332_fhd_configurator_0 ROM_INIT si5332_fhd.mif
set_instance_parameter_value si5332_fhd_configurator_0 ROM_SIZE 128
set_instance_parameter_value si5332_fhd_configurator_0 ROM_TYPE AUTO

add_instance si5332_xga_configurator_0 configurator 18.1
set_instance_parameter_value si5332_xga_configurator_0 ADDR_OUT_WIDTH 16
set_instance_parameter_value si5332_xga_configurator_0 DATA_OUT_WIDTH 8
set_instance_parameter_value si5332_xga_configurator_0 DELAY_MS 0
set_instance_parameter_value si5332_xga_configurator_0 FAMILY {Cyclone V}
set_instance_parameter_value si5332_xga_configurator_0 INPUT_FREQ 100000000
set_instance_parameter_value si5332_xga_configurator_0 ROM_INIT si5332_xga.mif
set_instance_parameter_value si5332_xga_configurator_0 ROM_SIZE 128
set_instance_parameter_value si5332_xga_configurator_0 ROM_TYPE AUTO

add_instance si5332_vga_configurator_0 configurator 18.1
set_instance_parameter_value si5332_vga_configurator_0 ADDR_OUT_WIDTH 16
set_instance_parameter_value si5332_vga_configurator_0 DATA_OUT_WIDTH 8
set_instance_parameter_value si5332_vga_configurator_0 DELAY_MS 0
set_instance_parameter_value si5332_vga_configurator_0 FAMILY {Cyclone V}
set_instance_parameter_value si5332_vga_configurator_0 INPUT_FREQ 100000000
set_instance_parameter_value si5332_vga_configurator_0 ROM_INIT si5332_vga.mif
set_instance_parameter_value si5332_vga_configurator_0 ROM_SIZE 128
set_instance_parameter_value si5332_vga_configurator_0 ROM_TYPE AUTO

add_instance video_ic_configurator_0 configurator 18.1
set_instance_parameter_value video_ic_configurator_0 ADDR_OUT_WIDTH 16
set_instance_parameter_value video_ic_configurator_0 DATA_OUT_WIDTH 8
set_instance_parameter_value video_ic_configurator_0 DELAY_MS 100
set_instance_parameter_value video_ic_configurator_0 FAMILY {Cyclone V}
set_instance_parameter_value video_ic_configurator_0 INPUT_FREQ 100000000
set_instance_parameter_value video_ic_configurator_0 ROM_INIT video_ic.mif
set_instance_parameter_value video_ic_configurator_0 ROM_SIZE 512
set_instance_parameter_value video_ic_configurator_0 ROM_TYPE AUTO

add_instance ams_i2c_1 ams_i2c 18.0
set_instance_parameter_value ams_i2c_1 baudrate 100000
set_instance_parameter_value ams_i2c_1 clock_freq 80000000

add_instance pu_0 pu 18.1
set_instance_parameter_value pu_0 CLOCK_FREQ 80000000
set_instance_parameter_value pu_0 COEF_BASE_ADDRESS 0
set_instance_parameter_value pu_0 DEFAULT_LIGHT 16
set_instance_parameter_value pu_0 LCD_DAC_TYPE PWM
set_instance_parameter_value pu_0 PU_BASE_ADDRESS 0
set_instance_parameter_value pu_0 PU_DAC_TYPE PWM
set_instance_parameter_value pu_0 PWM_FREQ 1000

add_instance pu_backlight_rom_0 altera_avalon_onchip_memory2 18.1
set_instance_parameter_value pu_backlight_rom_0 allowInSystemMemoryContentEditor true
set_instance_parameter_value pu_backlight_rom_0 dataWidth 32
set_instance_parameter_value pu_backlight_rom_0 dualPort false
set_instance_parameter_value pu_backlight_rom_0 initMemContent true
set_instance_parameter_value pu_backlight_rom_0 initializationFileName backlight.mif
set_instance_parameter_value pu_backlight_rom_0 instanceID BKLT
set_instance_parameter_value pu_backlight_rom_0 memorySize 2048
set_instance_parameter_value pu_backlight_rom_0 useNonDefaultInitFile true
set_instance_parameter_value pu_backlight_rom_0 writable false

add_instance video_core_configurator configurator 18.1
set_instance_parameter_value video_core_configurator ADDR_OUT_WIDTH 16
set_instance_parameter_value video_core_configurator DATA_OUT_WIDTH 16
set_instance_parameter_value video_core_configurator DELAY_MS 100
set_instance_parameter_value video_core_configurator FAMILY {Cyclone V}
set_instance_parameter_value video_core_configurator INPUT_FREQ 100000000
set_instance_parameter_value video_core_configurator ROM_INIT video_init.mif
set_instance_parameter_value video_core_configurator ROM_SIZE 256
set_instance_parameter_value video_core_configurator ROM_TYPE AUTO

add_instance vc_configurator_fhd configurator 18.1
set_instance_parameter_value vc_configurator_fhd ADDR_OUT_WIDTH 16
set_instance_parameter_value vc_configurator_fhd DATA_OUT_WIDTH 16
set_instance_parameter_value vc_configurator_fhd DELAY_MS 0
set_instance_parameter_value vc_configurator_fhd FAMILY {Cyclone V}
set_instance_parameter_value vc_configurator_fhd INPUT_FREQ 100000000
set_instance_parameter_value vc_configurator_fhd ROM_INIT video_init_fhd.mif
set_instance_parameter_value vc_configurator_fhd ROM_SIZE 32
set_instance_parameter_value vc_configurator_fhd ROM_TYPE AUTO

add_instance vc_configurator_xga configurator 18.1
set_instance_parameter_value vc_configurator_xga ADDR_OUT_WIDTH 16
set_instance_parameter_value vc_configurator_xga DATA_OUT_WIDTH 16
set_instance_parameter_value vc_configurator_xga DELAY_MS 0
set_instance_parameter_value vc_configurator_xga FAMILY {Cyclone V}
set_instance_parameter_value vc_configurator_xga INPUT_FREQ 100000000
set_instance_parameter_value vc_configurator_xga ROM_INIT video_init_xga.mif
set_instance_parameter_value vc_configurator_xga ROM_SIZE 32
set_instance_parameter_value vc_configurator_xga ROM_TYPE AUTO

add_instance videocore_cnfg_0 videocore_cnfg 1.0
set_instance_parameter_value videocore_cnfg_0 VIDECORE_ADDR 0

add_instance video_core_0 video 1.0

add_instance arinc429_0 arinc429 1.0
set_instance_parameter_value arinc429_0 INPUTFREQUENCY 62500000
set_instance_parameter_value arinc429_0 REC_NUMB 16
set_instance_parameter_value arinc429_0 TR_NUMB 6

add_instance arinc708_0 arinc708 1.0
set_instance_parameter_value arinc708_0 INPUTFREQUENCY 62500000
set_instance_parameter_value arinc708_0 REC_NUMB 2

add_instance discr_cmd_in_0 discr_cmd_in 18.1
set_instance_parameter_value discr_cmd_in_0 COUNT 8

add_instance discr_cmd_out_0 discr_cmd_out 18.1
set_instance_parameter_value discr_cmd_out_0 CLOCK_FREQ 100000000
set_instance_parameter_value discr_cmd_out_0 COUNT 4
set_instance_parameter_value discr_cmd_out_0 TIMEOUT_MS 500

# connections
add_connection ddr_clock_bridge_0.out_clk ddr_reset_bridge_0.clk clock
add_connection ddr_clock_bridge_0.out_clk discr_cmd_in_0.clock clock
add_connection ddr_clock_bridge_0.out_clk discr_cmd_out_0.clock clock
add_connection ddr_clock_bridge_0.out_clk nios_to_ddr_bridge_0.m0_clk clock
add_connection ddr_clock_bridge_0.out_clk pci_to_ddr_bridge_0.m0_clk clock
add_connection ddr_clock_bridge_0.out_clk vc_configurator_fhd.clock_sink clock
add_connection ddr_clock_bridge_0.out_clk vc_configurator_xga.clock_sink clock
add_connection ddr_clock_bridge_0.out_clk video_core_0.clk_in_0 clock
add_connection ddr_clock_bridge_0.out_clk video_core_configurator.clock_sink clock
add_connection ddr_clock_bridge_0.out_clk videocore_cnfg_0.clock clock
add_connection ddr_clock_bridge_1.out_clk video_core_0.clk_in_1 clock
add_connection nios_clock_bridge_0.out_clk ams_i2c_0.clock_sink clock
add_connection nios_clock_bridge_0.out_clk ams_i2c_1.clock_sink clock
add_connection nios_clock_bridge_0.out_clk avm_adv7613_check_0.clock_sink clock
add_connection nios_clock_bridge_0.out_clk dev_info_0.clock clock
add_connection nios_clock_bridge_0.out_clk hardware_rom_0.clk1 clock
add_connection nios_clock_bridge_0.out_clk info_ram_0.clk1 clock
add_connection nios_clock_bridge_0.out_clk jtag_uart_0.clk clock
add_connection nios_clock_bridge_0.out_clk nios2_gen2_0.clk clock
add_connection nios_clock_bridge_0.out_clk nios_ram_0.clk1 clock
add_connection nios_clock_bridge_0.out_clk nios_reset_bridge_0.clk clock
add_connection nios_clock_bridge_0.out_clk nios_rom_0.clk1 clock
add_connection nios_clock_bridge_0.out_clk nios_to_ddr_bridge_0.s0_clk clock
add_connection nios_clock_bridge_0.out_clk pcie_to_nios_bridge_0.m0_clk clock
add_connection nios_clock_bridge_0.out_clk pio_0.clk clock
add_connection nios_clock_bridge_0.out_clk pu_0.clock_sink clock
add_connection nios_clock_bridge_0.out_clk pu_backlight_rom_0.clk1 clock
add_connection nios_clock_bridge_0.out_clk si5332_fhd_configurator_0.clock_sink clock
add_connection nios_clock_bridge_0.out_clk si5332_vga_configurator_0.clock_sink clock
add_connection nios_clock_bridge_0.out_clk si5332_xga_configurator_0.clock_sink clock
add_connection nios_clock_bridge_0.out_clk sysid_qsys_0.clk clock
add_connection nios_clock_bridge_0.out_clk video_ic_configurator_0.clock_sink clock
add_connection pcie_cv_hip_avmm_0.coreclkout arinc429_0.clock clock
add_connection pcie_cv_hip_avmm_0.coreclkout arinc708_0.clock clock
add_connection pcie_cv_hip_avmm_0.coreclkout pci_to_ddr_bridge_0.s0_clk clock
add_connection pcie_cv_hip_avmm_0.coreclkout pcie_to_arinc_bridge.m0_clk clock
add_connection pcie_cv_hip_avmm_0.coreclkout pcie_to_arinc_bridge.s0_clk clock
add_connection pcie_cv_hip_avmm_0.coreclkout pcie_to_flash_bridge_0.s0_clk clock
add_connection pcie_cv_hip_avmm_0.coreclkout pcie_to_nios_bridge_0.s0_clk clock
add_connection por_0.clock_source_0 nios_clock_bridge_0.in_clk clock
add_connection por_0.clock_source_2 asmi_cntrlr_0.clock clock
add_connection por_0.clock_source_2 asmi_flash_cntrlr_0.clock clock
add_connection por_0.clock_source_2 asmi_parallel2_top_0.clk clock
add_connection por_0.clock_source_2 pcie_to_flash_bridge_0.m0_clk clock
add_connection por_0.clock_source_2 remote_update_0.clock clock
add_connection avm_adv7613_check_0.clock_output_reset video_ic_configurator_0.reset_sink reset
add_connection ddr_reset_bridge_0.out_reset discr_cmd_in_0.reset reset
add_connection ddr_reset_bridge_0.out_reset discr_cmd_out_0.reset reset
add_connection ddr_reset_bridge_0.out_reset nios_to_ddr_bridge_0.m0_reset reset
add_connection ddr_reset_bridge_0.out_reset pci_to_ddr_bridge_0.m0_reset reset
add_connection ddr_reset_bridge_0.out_reset pll_0.reset reset
add_connection ddr_reset_bridge_0.out_reset video_core_0.reset_in reset
add_connection nios_reset_bridge_0.out_reset ams_i2c_0.reset_sink reset
add_connection nios_reset_bridge_0.out_reset ams_i2c_1.reset_sink reset
add_connection nios_reset_bridge_0.out_reset avm_adv7613_check_0.clock_sink_reset reset
add_connection nios_reset_bridge_0.out_reset hardware_rom_0.reset1 reset
add_connection nios_reset_bridge_0.out_reset jtag_uart_0.reset reset
add_connection nios_reset_bridge_0.out_reset nios2_gen2_0.reset reset
add_connection nios_reset_bridge_0.out_reset nios_ram_0.reset1 reset
add_connection nios_reset_bridge_0.out_reset nios_rom_0.reset1 reset
add_connection nios_reset_bridge_0.out_reset nios_to_ddr_bridge_0.s0_reset reset
add_connection nios_reset_bridge_0.out_reset pcie_to_nios_bridge_0.m0_reset reset
add_connection nios_reset_bridge_0.out_reset pio_0.reset reset
add_connection nios_reset_bridge_0.out_reset pu_0.reset_sink reset
add_connection nios_reset_bridge_0.out_reset pu_backlight_rom_0.reset1 reset
add_connection nios_reset_bridge_0.out_reset sysid_qsys_0.reset reset
add_connection pcie_cv_hip_avmm_0.nreset_status arinc429_0.reset reset
add_connection pcie_cv_hip_avmm_0.nreset_status arinc708_0.reset reset
add_connection pcie_cv_hip_avmm_0.nreset_status pci_to_ddr_bridge_0.s0_reset reset
add_connection pcie_cv_hip_avmm_0.nreset_status pcie_to_arinc_bridge.m0_reset reset
add_connection pcie_cv_hip_avmm_0.nreset_status pcie_to_arinc_bridge.s0_reset reset
add_connection pcie_cv_hip_avmm_0.nreset_status pcie_to_flash_bridge_0.s0_reset reset
add_connection pcie_cv_hip_avmm_0.nreset_status pcie_to_nios_bridge_0.s0_reset reset
add_connection por_0.reset_source asmi_cntrlr_0.reset reset
add_connection por_0.reset_source asmi_flash_cntrlr_0.reset reset
add_connection por_0.reset_source asmi_parallel2_top_0.reset reset
add_connection por_0.reset_source ddr_reset_bridge_0.in_reset reset
add_connection por_0.reset_source dev_info_0.reset reset
add_connection por_0.reset_source info_ram_0.reset1 reset
add_connection por_0.reset_source nios_reset_bridge_0.in_reset reset
add_connection por_0.reset_source pcie_to_flash_bridge_0.m0_reset reset
add_connection por_0.reset_source remote_update_0.reset reset
add_connection pu_0.fhd_reset si5332_fhd_configurator_0.reset_sink reset
add_connection pu_0.fhd_reset vc_configurator_fhd.reset_sink reset
add_connection pu_0.pu_ready_reset video_ic_configurator_0.reset_sink reset
add_connection pu_0.vga_reset si5332_vga_configurator_0.reset_sink reset
add_connection pu_0.xga_reset si5332_xga_configurator_0.reset_sink reset
add_connection pu_0.xga_reset vc_configurator_xga.reset_sink reset
add_connection si5332_xga_configurator_0.reset_source videocore_cnfg_0.reset reset
add_connection video_core_configurator.reset_source vc_configurator_fhd.reset_sink reset
add_connection video_core_configurator.reset_source vc_configurator_xga.reset_sink reset
add_connection video_ic_configurator_0.reset_source si5332_fhd_configurator_0.reset_sink reset
add_connection video_ic_configurator_0.reset_source si5332_vga_configurator_0.reset_sink reset
add_connection video_ic_configurator_0.reset_source si5332_xga_configurator_0.reset_sink reset
add_connection video_ic_configurator_0.reset_source video_core_configurator.reset_sink reset
add_connection asmi_cntrlr_0.asmi_avalon_master asmi_parallel2_top_0.avl_csr avalon
set_connection_parameter_value asmi_cntrlr_0.asmi_avalon_master/asmi_parallel2_top_0.avl_csr baseAddress 0x02000000
add_connection asmi_cntrlr_0.asmi_avalon_master asmi_parallel2_top_0.avl_mem avalon
set_connection_parameter_value asmi_cntrlr_0.asmi_avalon_master/asmi_parallel2_top_0.avl_mem baseAddress 0x0000
add_connection asmi_cntrlr_0.ru_avalon_master remote_update_0.avl_csr avalon
set_connection_parameter_value asmi_cntrlr_0.ru_avalon_master/remote_update_0.avl_csr baseAddress 0x0000
add_connection asmi_flash_cntrlr_0.amm_mem asmi_parallel2_top_0.avl_csr avalon
set_connection_parameter_value asmi_flash_cntrlr_0.amm_mem/asmi_parallel2_top_0.avl_csr baseAddress 0x02000000
add_connection asmi_flash_cntrlr_0.amm_mem asmi_parallel2_top_0.avl_mem avalon
set_connection_parameter_value asmi_flash_cntrlr_0.amm_mem/asmi_parallel2_top_0.avl_mem baseAddress 0x0000
add_connection avm_adv7613_check_0.avm_master ams_i2c_0.ams avalon
set_connection_parameter_value avm_adv7613_check_0.avm_master/ams_i2c_0.ams baseAddress 0x0000
add_connection nios2_gen2_0.data_master ams_i2c_0.ams avalon
set_connection_parameter_value nios2_gen2_0.data_master/ams_i2c_0.ams baseAddress 0x00100000
add_connection nios2_gen2_0.data_master ams_i2c_1.ams avalon
set_connection_parameter_value nios2_gen2_0.data_master/ams_i2c_1.ams baseAddress 0x00110000
add_connection nios2_gen2_0.data_master asmi_cntrlr_0.csr avalon
set_connection_parameter_value nios2_gen2_0.data_master/asmi_cntrlr_0.csr baseAddress 0x0000
add_connection nios2_gen2_0.data_master jtag_uart_0.avalon_jtag_slave avalon
set_connection_parameter_value nios2_gen2_0.data_master/jtag_uart_0.avalon_jtag_slave baseAddress 0x01011090
add_connection nios2_gen2_0.data_master nios2_gen2_0.debug_mem_slave avalon
set_connection_parameter_value nios2_gen2_0.data_master/nios2_gen2_0.debug_mem_slave baseAddress 0x10000000
add_connection nios2_gen2_0.data_master nios_ram_0.s1 avalon
set_connection_parameter_value nios2_gen2_0.data_master/nios_ram_0.s1 baseAddress 0x08000000
add_connection nios2_gen2_0.data_master nios_rom_0.s1 avalon
set_connection_parameter_value nios2_gen2_0.data_master/nios_rom_0.s1 baseAddress 0x08008000
add_connection nios2_gen2_0.data_master nios_to_ddr_bridge_0.s0 avalon
set_connection_parameter_value nios2_gen2_0.data_master/nios_to_ddr_bridge_0.s0 baseAddress 0x00400000
add_connection nios2_gen2_0.data_master pio_0.s1 avalon
set_connection_parameter_value nios2_gen2_0.data_master/pio_0.s1 baseAddress 0x01011000
add_connection nios2_gen2_0.data_master pu_0.csr avalon
set_connection_parameter_value nios2_gen2_0.data_master/pu_0.csr baseAddress 0x00120000
add_connection nios2_gen2_0.data_master pu_backlight_rom_0.s1 avalon
set_connection_parameter_value nios2_gen2_0.data_master/pu_backlight_rom_0.s1 baseAddress 0x00020000
add_connection nios2_gen2_0.data_master sysid_qsys_0.control_slave avalon
set_connection_parameter_value nios2_gen2_0.data_master/sysid_qsys_0.control_slave baseAddress 0x10000800
add_connection nios2_gen2_0.instruction_master nios2_gen2_0.debug_mem_slave avalon
set_connection_parameter_value nios2_gen2_0.instruction_master/nios2_gen2_0.debug_mem_slave baseAddress 0x10000000
add_connection nios2_gen2_0.instruction_master nios_ram_0.s1 avalon
set_connection_parameter_value nios2_gen2_0.instruction_master/nios_ram_0.s1 baseAddress 0x08000000
add_connection nios2_gen2_0.instruction_master nios_rom_0.s1 avalon
set_connection_parameter_value nios2_gen2_0.instruction_master/nios_rom_0.s1 baseAddress 0x08008000
add_connection nios_to_ddr_bridge_0.m0 arinc429_0.ams avalon
set_connection_parameter_value nios_to_ddr_bridge_0.m0/arinc429_0.ams baseAddress 0x0000
add_connection nios_to_ddr_bridge_0.m0 discr_cmd_in_0.csr avalon
set_connection_parameter_value nios_to_ddr_bridge_0.m0/discr_cmd_in_0.csr baseAddress 0x00224100
add_connection nios_to_ddr_bridge_0.m0 discr_cmd_out_0.csr avalon
set_connection_parameter_value nios_to_ddr_bridge_0.m0/discr_cmd_out_0.csr baseAddress 0x00224110
add_connection nios_to_ddr_bridge_0.m0 video_core_0.csr avalon
set_connection_parameter_value nios_to_ddr_bridge_0.m0/video_core_0.csr baseAddress 0x00220000
add_connection pci_to_ddr_bridge_0.m0 discr_cmd_in_0.csr avalon
set_connection_parameter_value pci_to_ddr_bridge_0.m0/discr_cmd_in_0.csr baseAddress 0x00020000
add_connection pci_to_ddr_bridge_0.m0 discr_cmd_out_0.csr avalon
set_connection_parameter_value pci_to_ddr_bridge_0.m0/discr_cmd_out_0.csr baseAddress 0x00020010
add_connection pci_to_ddr_bridge_0.m0 video_core_0.csr avalon
set_connection_parameter_value pci_to_ddr_bridge_0.m0/video_core_0.csr baseAddress 0x0000
add_connection pcie_cv_hip_avmm_0.Rxm_BAR0 pci_to_ddr_bridge_0.s0 avalon
set_connection_parameter_value pcie_cv_hip_avmm_0.Rxm_BAR0/pci_to_ddr_bridge_0.s0 baseAddress 0x00300000
add_connection pcie_cv_hip_avmm_0.Rxm_BAR0 pcie_to_arinc_bridge.s0 avalon
set_connection_parameter_value pcie_cv_hip_avmm_0.Rxm_BAR0/pcie_to_arinc_bridge.s0 baseAddress 0x00400000
add_connection pcie_cv_hip_avmm_0.Rxm_BAR0 pcie_to_flash_bridge_0.s0 avalon
set_connection_parameter_value pcie_cv_hip_avmm_0.Rxm_BAR0/pcie_to_flash_bridge_0.s0 baseAddress 0x00200000
add_connection pcie_cv_hip_avmm_0.Rxm_BAR0 pcie_to_nios_bridge_0.s0 avalon
set_connection_parameter_value pcie_cv_hip_avmm_0.Rxm_BAR0/pcie_to_nios_bridge_0.s0 baseAddress 0x0000
add_connection pcie_to_arinc_bridge.m0 arinc429_0.ams avalon
set_connection_parameter_value pcie_to_arinc_bridge.m0/arinc429_0.ams baseAddress 0x0000
add_connection pcie_to_arinc_bridge.m0 arinc708_0.ams avalon
set_connection_parameter_value pcie_to_arinc_bridge.m0/arinc708_0.ams baseAddress 0x00200000
add_connection pcie_to_flash_bridge_0.m0 asmi_cntrlr_0.csr avalon
set_connection_parameter_value pcie_to_flash_bridge_0.m0/asmi_cntrlr_0.csr baseAddress 0x0000
add_connection pcie_to_flash_bridge_0.m0 asmi_flash_cntrlr_0.ams_mem avalon
set_connection_parameter_value pcie_to_flash_bridge_0.m0/asmi_flash_cntrlr_0.ams_mem baseAddress 0x0000
add_connection pcie_to_nios_bridge_0.m0 ams_i2c_1.ams avalon
set_connection_parameter_value pcie_to_nios_bridge_0.m0/ams_i2c_1.ams baseAddress 0x00110000
add_connection pcie_to_nios_bridge_0.m0 dev_info_0.ams avalon
set_connection_parameter_value pcie_to_nios_bridge_0.m0/dev_info_0.ams baseAddress 0x00010000
add_connection pcie_to_nios_bridge_0.m0 hardware_rom_0.s1 avalon
